# Altium schematic sheet Powerstage.SchDoc
size A3; SheetNumber: 3; SheetTotal: 4
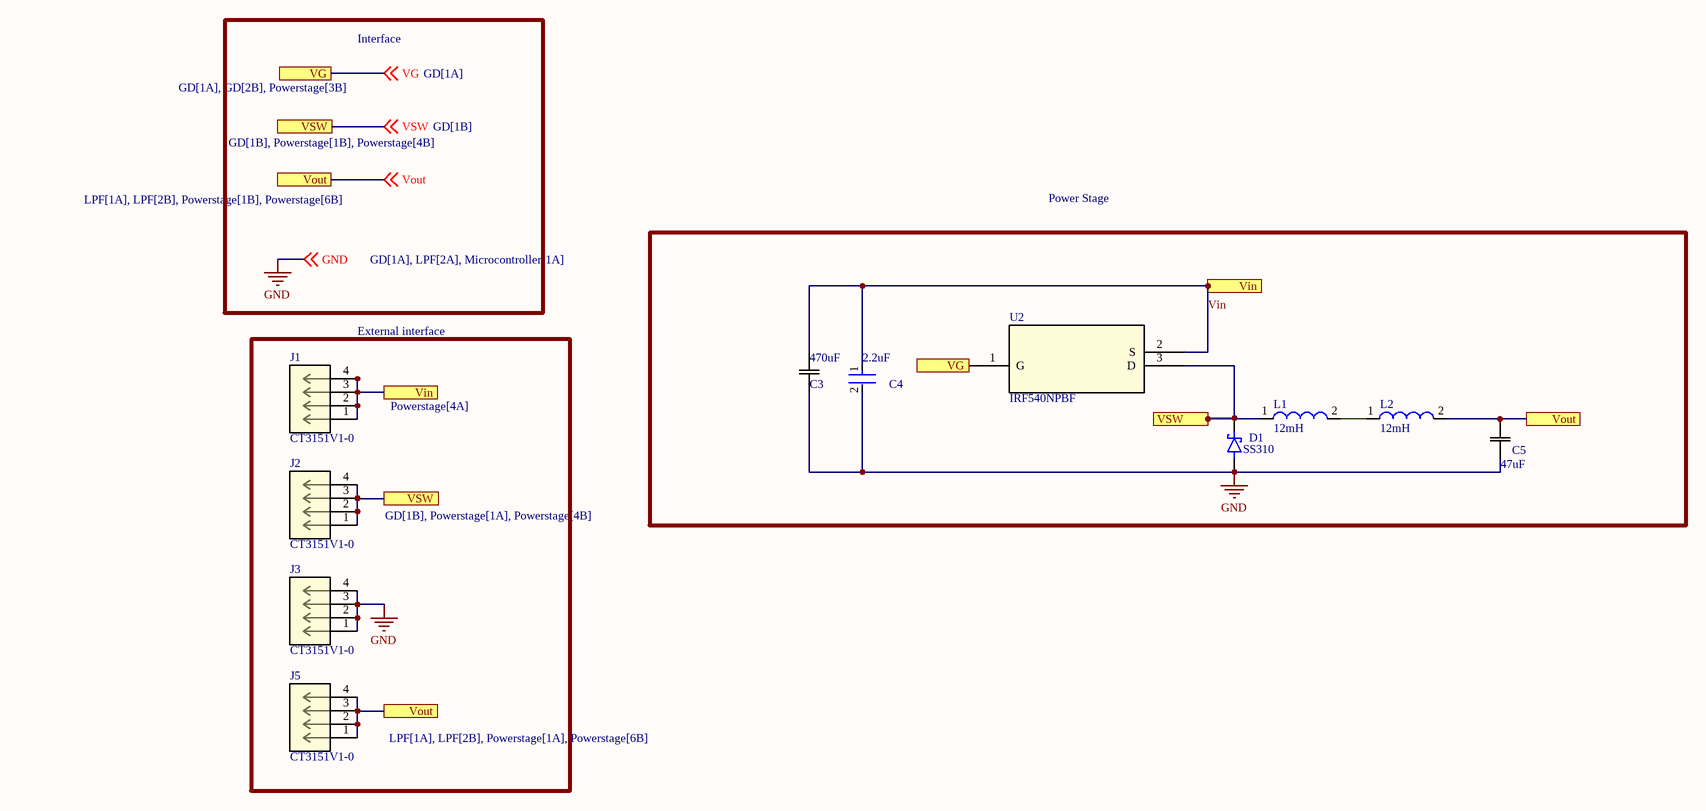
[diagram p0: Powerstage.SchDoc]

## Parts
C3  470uF  [U1-GG_NCH]
C4  2.2uF  [FP-GRM21B-0_2-e0_2_0_7-IPC_A]
C5  47uF  [CAP_YX_16X31P5_RUB]
D1  SS310  [DIO_SS310]
J1  CT3151V1-0  [CON4_CT3151V1-0_CTE]
J2  CT3151V1-0  [CON4_CT3151V1-0_CTE]
J3  CT3151V1-0  [CON4_CT3151V1-0_CTE]
J5  CT3151V1-0  [CON4_CT3151V1-0_CTE]
L1  value 12mH  [INDRD2921W163D3810H2616P]  (hidden comment: 1140-123K-RC)
L2  value 12mH  [INDRD2921W163D3810H2616P]  (hidden comment: 1140-123K-RC)
U2  IRF540NPBF  [PG-TO220-3_INF]

## Blocks framed on the sheet
External interface: J1-J3 J5

## Ports
VG (see GD[1A], GD[2B], Powerstage[1A]), VG (see GD[1A], GD[2B], Powerstage[3B]), Vin (see Powerstage[1B]), Vin (see Powerstage[4A]), Vout (see LPF[1A], LPF[2B], Powerstage[1A], Powerstage[1B]), Vout (see LPF[1A], LPF[2B], Powerstage[1A], Powerstage[6B]), Vout (see LPF[1A], LPF[2B], Powerstage[1B], Powerstage[6B]), VSW (see GD[1B], Powerstage[1A], Powerstage[1B]), VSW (see GD[1B], Powerstage[1A], Powerstage[4B]), VSW (see GD[1B], Powerstage[1B], Powerstage[4B])

## Nets
GND: C3.1 C4.2 C5.1 D1.A J3.1 J3.2 J3.3 J3.4 ; off-sheet GND
VG: U2.1(G) ; off-sheet VG, port VG
Vin: C3.2 C4.1 J1.1 J1.2 J1.3 J1.4 U2.2(S) ; port Vin
Vout: C5.2 J5.1 J5.2 J5.3 J5.4 L2.2 ; off-sheet Vout, port Vout
VSW: D1.C(K) J2.1 J2.2 J2.3 J2.4 L1.1 U2.3(D) ; off-sheet VSW, port VSW
NetL1_2: L1.2 L2.1

## Notes on the sheet
- Interface
- Power Stage

## Library data of the parts
C3 = CMP-001-00112-1: UVZ2A471MHD; Mfr_Name: Nichicon; Design Item ID: UVZ2A471MHD; Source: UVZ2A471MHD.SchLib
C4 = CMP-06035-000063-2: Chip Multilayer Ceramic Capacitors for General Purpose, 0805, 2.2uF, X7S, 22%, 10%, 100V, GRM21BD72A225KE01L; Capacitance: 1uF; Tolerance: 10%; Length: 2mm; Voltage Rating (DC): 100V; Thickness: 1.25mm; Dielectric: X7S; Width: 1.25mm
C5 = CMP-001-00103-1: ESL476M100AH9AA; Mfr_Name: Rubycon; Design Item ID: 100ZLH470MEFC16X31.5; Source: 100ZLH470MEFC16X31P5.SchLib
D1 = CMP-004-00044-1: 3A, 100V, Schottky Rectifier; MF: Taiwan Semiconductor; Value: *; Pins: 2; Design Item ID: SS310; Source: SS310.SchLib; Component Type: Standard; SnapEDA_Link: https://www.snapeda.com/parts/SS310/Taiwan+Semiconductor/view-part/?ref=snap; Check_prices: https://www.snapeda.com/parts/SS310/Taiwan+Semiconductor/view-part/?ref=eda; Case/Package: DO-214AB-2 Taiwan Semiconductor; MP: SS310
J1-J3 J5 = CMP-261-000000-2: No Description Available; Mfr_Name: CAL TEST ELECTRONICS; RefDes: RefDes; Design Item ID: CT3151V1-0; Type: Type; Source: CT3151V1-0.SchLib
L1 L2 = CMP-006-00034-2: 12mH Unshielded Wirewound Inductor 900mA 3.04Ohm Max Radial; MF: Bourns; Design Item ID: 1140-123K-RC; SnapEDA_Link: https://www.snapeda.com/parts/1140-123K-RC/Bourns%20-%20J.W.%20Miller/view-part/259636/?ref=snap; Source: SnapEDAsch.SchLib; MP: 1140-123K-RC; Case/Package: Radial Bourns; Availability: Unavailable; Price: None; Component Type: Standard; Pins: 2
U2 = CMP-306-000000-1: No Description Available; Mfr_Name: Infineon; Type: Type; Design Item ID: IRF540NPBF; Source: IRF540NPBF.SchLib; RefDes: RefDes